# Altium schematic sheet Test Board.SchDoc
size A4; SheetNumber: 1; SheetTotal: 1
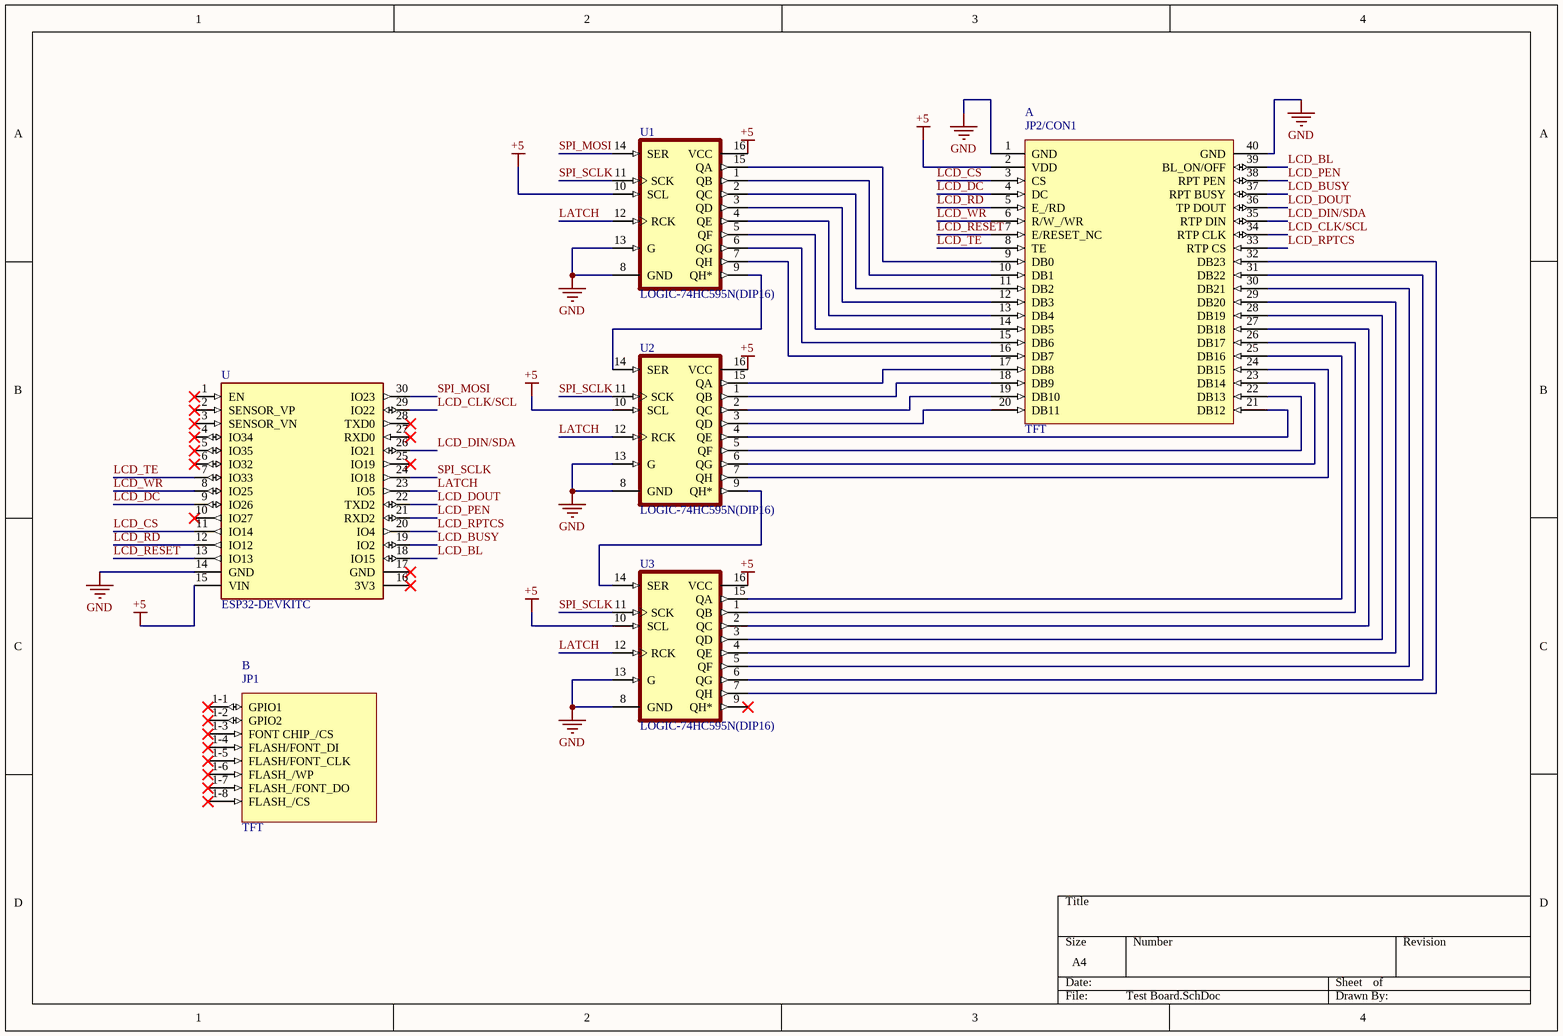
[diagram p0: Test Board.SchDoc]

## Parts
(Parts that share a designator on the sheet are numbered #1, #2 ... from top to bottom, then left to right.)
?#1  TFT  [Female Header 20x2]  (part A of 2)
?#2  TFT  [Female Header 20x2]  (part B of 2)
U  ESP32-DEVKITC  [MODULE_ESP32-DEVKITC]
U1  LOGIC-74HC595N(DIP16)  [SO16]
U2  LOGIC-74HC595N(DIP16)  [SO16]
U3  LOGIC-74HC595N(DIP16)  [SO16]

## Nets
+5: ?#1.2(VDD) U.15(VIN) U1.10(SCL) U1.16(VCC) U2.10(SCL) U2.16(VCC) U3.10(SCL) U3.16(VCC)
GND: ?#1.1(GND) ?#1.40(GND) U.14(GND) U1.8(GND) U1.13(G) U2.8(GND) U2.13(G) U3.8(GND) U3.13(G)
LATCH: U.23(IO5) U1.12(RCK) U2.12(RCK) U3.12(RCK)
LCD_BL: ?#1.39(BL_ON/OFF) U.18(IO15)
LCD_BUSY: ?#1.37(RPT_BUSY) U.19(IO2)
LCD_CLK/SCL: ?#1.34(RTP_CLK) U.29(IO22)
LCD_CS: ?#1.3(CS) U.11(IO14)
LCD_DC: ?#1.4(DC) U.9(IO26)
LCD_DIN/SDA: ?#1.35(RTP_DIN) U.26(IO21)
LCD_DOUT: ?#1.36(TP_DOUT) U.22(TXD2)
LCD_PEN: ?#1.38(RPT_PEN) U.21(RXD2)
LCD_RD: ?#1.5(E_/RD) U.12(IO12)
LCD_RESET: ?#1.7(E/RESET_NC) U.13(IO13)
LCD_RPTCS: ?#1.33(RTP_CS) U.20(IO4)
LCD_TE: ?#1.8(TE) U.7(IO33)
LCD_WR: ?#1.6(R/W_/WR) U.8(IO25)
SPI_MOSI: U.30(IO23) U1.14(SER)
SPI_SCLK: U.24(IO18) U1.11(SCK) U2.11(SCK) U3.11(SCK)
Net?#1_9: ?#1.9(DB0) U1.15(QA)
Net?#1_10: ?#1.10(DB1) U1.1(QB)
Net?#1_11: ?#1.11(DB2) U1.2(QC)
Net?#1_12: ?#1.12(DB3) U1.3(QD)
Net?#1_13: ?#1.13(DB4) U1.4(QE)
Net?#1_14: ?#1.14(DB5) U1.5(QF)
Net?#1_15: ?#1.15(DB6) U1.6(QG)
Net?#1_16: ?#1.16(DB7) U1.7(QH)
Net?#1_17: ?#1.17(DB8) U2.15(QA)
Net?#1_18: ?#1.18(DB9) U2.1(QB)
Net?#1_19: ?#1.19(DB10) U2.2(QC)
Net?#1_20: ?#1.20(DB11) U2.3(QD)
Net?#1_21: ?#1.21(DB12) U2.4(QE)
Net?#1_22: ?#1.22(DB13) U2.5(QF)
Net?#1_23: ?#1.23(DB14) U2.6(QG)
Net?#1_24: ?#1.24(DB15) U2.7(QH)
Net?#1_25: ?#1.25(DB16) U3.15(QA)
Net?#1_26: ?#1.26(DB17) U3.1(QB)
Net?#1_27: ?#1.27(DB18) U3.2(QC)
Net?#1_28: ?#1.28(DB19) U3.3(QD)
Net?#1_29: ?#1.29(DB20) U3.4(QE)
Net?#1_30: ?#1.30(DB21) U3.5(QF)
Net?#1_31: ?#1.31(DB22) U3.6(QG)
Net?#1_32: ?#1.32(DB23) U3.7(QH)
NetU1_9: U1.9(QH*) U2.14(SER)
NetU2_9: U2.9(QH*) U3.14(SER)

Not connected (* = marked no-connect by the designer): ?#2 1-1(GPIO1)* 1-2(GPIO2)* 1-3(FONT_CHIP_/CS)* 1-4(FLASH/FONT_DI)* 1-5(FLASH/FONT_CLK)* 1-6(FLASH_/WP)* 1-7(FLASH_/FONT_DO)* 1-8(FLASH_/CS)*; U 1(EN)* 2(SENSOR_VP)* 3(SENSOR_VN)* 4(IO34)* 5(IO35)* 6(IO32)* 10(IO27)* 16(3V3)* 17(GND)* 25(IO19)* 27(RXD0)* 28(TXD0)*; U3 9(QH*)*

## Notes on the sheet
- (in symbol TFT, part A) JP2/CON1
- (in symbol TFT, part B) JP1

## Library data of the parts
U = ESP32-DEVKITC: - Transceiver; 802.11 b/g/n _Wi-Fi, WiFi, WLAN_, BluetoothÂ® Smart Ready 4.x Dual Mode For Use With ESP-WROOM-32; MP: ESP32-DEVKITC-32D-F; MF: Espressif Systems; Price: None; SnapEDA_Link: https://www.snapeda.com/parts/ESP32-DEVKITC-32D-F/Espressif%20Systems/view-part/4220172/?ref=snap; Availability: Unavailable; Value: *; Package: None
U1-U3 = LOGIC-74HC595N(DIP16): Shift Shift Register 1 Element 8 Bit 16-PDIP; MF: Texas Instruments; Check_prices: https://www.snapeda.com/parts/74HC595N/Texas+Instruments/view-part/?ref=eda; Value: *; Availability: In Stock; MP: 74HC595N; Price: None; Package: SOT38-4-16 Nexperia; SnapEDA_Link: https://www.snapeda.com/parts/74HC595N/Texas+Instruments/view-part/?ref=snap; Purchase-URL: https://pricing.snapeda.com/search/part/74HC595N/?ref=eda